# Altium project Mixed Signal Board.PrjPcb (part 2 of 2)
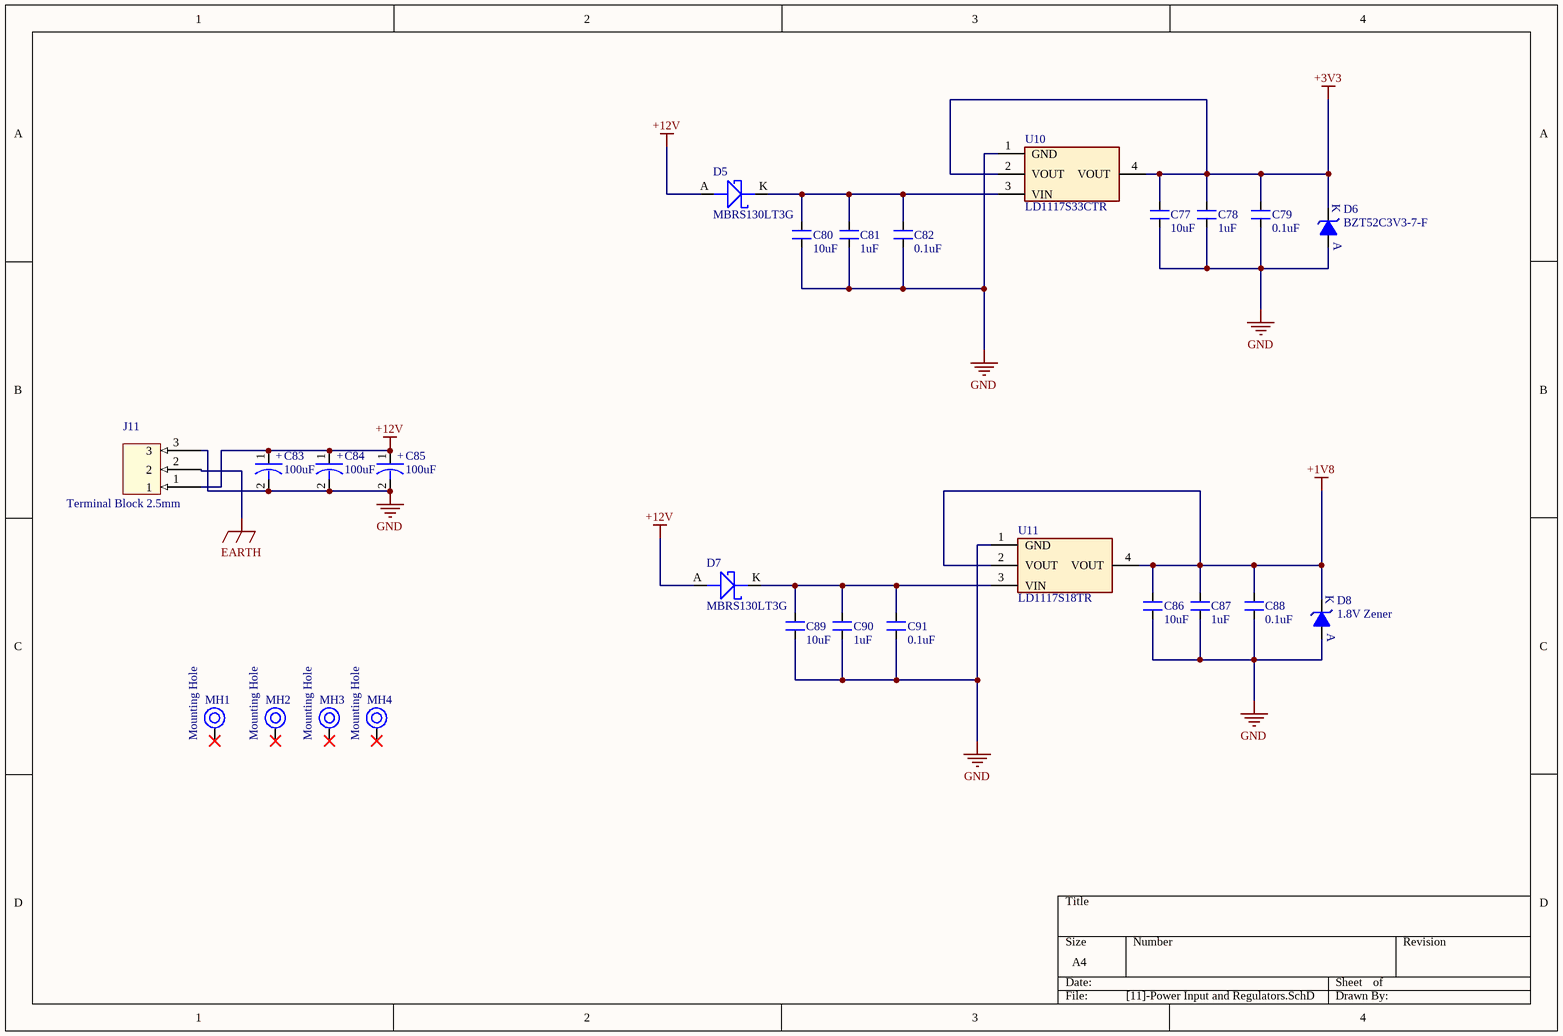
[diagram p11: [11]-Power Input and Regulators.SchDoc]

## Nets that join several sheets
+1V8: [8]- DAC and MIC (C37.2 C38.2 FB3.1 U6.34), [11]-Power Input and Regulators (6 pins)
+3V3: [3]-STM32F103_debugger (14 pins), [4]-Ethernet_PHY (10 pins), [5]-Motor Driver Schematic (R23.1), [6]-CH340C (C27.2 U4.4 U4.16), [7]-ADC Chip (8 pins), [8]- DAC and MIC (12 pins), [9]-STM32F407 Controller (20 pins), [10]-Motor Driver Schematic - 2 (R47.1), [11]-Power Input and Regulators (6 pins)
+12V: [5]-Motor Driver Schematic (7 pins), [10]-Motor Driver Schematic - 2 (6 pins), [11]-Power Input and Regulators (6 pins)
EARTH: [4]-Ethernet_PHY (C21.1 R12.1), [11]-Power Input and Regulators (J11.2)
GND: [3]-STM32F103_debugger (19 pins), [4]-Ethernet_PHY (20 pins), [5]-Motor Driver Schematic (12 pins), [6]-CH340C (C27.1 J5.5 J5.6 U4.1), [7]-ADC Chip (10 pins), [8]- DAC and MIC (25 pins), [9]-STM32F407 Controller (28 pins), [10]-Motor Driver Schematic - 2 (11 pins), [11]-Power Input and Regulators (20 pins)
COL: [4]-Ethernet_PHY (DS1.A U2.28), [9]-STM32F407 Controller (U8.26)
CRS: [4]-Ethernet_PHY (DS2.A U2.29), [9]-STM32F407 Controller (U8.23)
NetR10_1: [4]-Ethernet_PHY (R10.1 U2.11), [9]-STM32F407 Controller (U8.25)
NetR24_2: [5]-Motor Driver Schematic (R24.2 U3.14), [9]-STM32F407 Controller (U8.45)
NetR25_1: [7]-ADC Chip (R25.1 U5.3), [9]-STM32F407 Controller (U8.55)
NetR26_1: [7]-ADC Chip (R26.1 U5.16), [8]- DAC and MIC (U6.2), [9]-STM32F407 Controller (U8.92)
NetR27_1: [7]-ADC Chip (R27.1 U5.15), [8]- DAC and MIC (U6.1), [9]-STM32F407 Controller (U8.93)
NetR32_1: [8]- DAC and MIC (R32.1 U6.32), [9]-STM32F407 Controller (U8.54)
NetR48_2: [9]-STM32F407 Controller (U8.66), [10]-Motor Driver Schematic - 2 (R48.2 U9.14)
NetU1_25: [3]-STM32F103_debugger (U1.25 U1.27), [9]-STM32F407 Controller (U8.72)
NetU1_26: [3]-STM32F103_debugger (U1.26), [9]-STM32F407 Controller (U8.76)
NetU2_12: [4]-Ethernet_PHY (U2.12), [9]-STM32F407 Controller (U8.16)
NetU2_13: [4]-Ethernet_PHY (U2.13), [9]-STM32F407 Controller (U8.36)
NetU2_14: [4]-Ethernet_PHY (U2.14), [9]-STM32F407 Controller (U8.35)
NetU2_15: [4]-Ethernet_PHY (U2.15), [9]-STM32F407 Controller (U8.34)
NetU2_16: [4]-Ethernet_PHY (U2.16), [9]-STM32F407 Controller (U8.33)
NetU2_18: [4]-Ethernet_PHY (U2.18), [9]-STM32F407 Controller (U8.32)
NetU2_19: [4]-Ethernet_PHY (U2.19), [9]-STM32F407 Controller (U8.24)
NetU2_20: [4]-Ethernet_PHY (U2.20), [9]-STM32F407 Controller (U8.47)
NetU2_22: [4]-Ethernet_PHY (U2.22), [9]-STM32F407 Controller (U8.18)
NetU2_23: [4]-Ethernet_PHY (U2.23), [9]-STM32F407 Controller (U8.48)
NetU2_24: [4]-Ethernet_PHY (U2.24), [9]-STM32F407 Controller (U8.51)
NetU2_25: [4]-Ethernet_PHY (U2.25), [9]-STM32F407 Controller (U8.52)
NetU2_26: [4]-Ethernet_PHY (U2.26), [9]-STM32F407 Controller (U8.17)
NetU2_27: [4]-Ethernet_PHY (U2.27), [9]-STM32F407 Controller (U8.1)
NetU3_11: [5]-Motor Driver Schematic (U3.11), [9]-STM32F407 Controller (U8.30)
NetU3_15: [5]-Motor Driver Schematic (U3.15), [9]-STM32F407 Controller (U8.63)
NetU4_2: [6]-CH340C (U4.2), [9]-STM32F407 Controller (U8.78)
NetU4_3: [6]-CH340C (U4.3), [9]-STM32F407 Controller (U8.79)
NetU4_14: [6]-CH340C (U4.14), [9]-STM32F407 Controller (U8.57)
NetU5_14: [7]-ADC Chip (U5.14), [9]-STM32F407 Controller (U8.56)
NetU6_37: [8]- DAC and MIC (U6.37), [9]-STM32F407 Controller (U8.29)
NetU6_38: [8]- DAC and MIC (U6.38), [9]-STM32F407 Controller (U8.89)
NetU6_39: [8]- DAC and MIC (U6.39), [9]-STM32F407 Controller (U8.80)
NetU6_40: [8]- DAC and MIC (U6.40), [9]-STM32F407 Controller (U8.90)
NetU7_3: [8]- DAC and MIC (U7.3), [9]-STM32F407 Controller (U8.65)
NetU7_4: [8]- DAC and MIC (U7.4), [9]-STM32F407 Controller (U8.53)
NetU8_31: [9]-STM32F407 Controller (U8.31), [10]-Motor Driver Schematic - 2 (U9.11)
NetU8_60: [9]-STM32F407 Controller (U8.60), [10]-Motor Driver Schematic - 2 (U9.15)
nFAULT: [5]-Motor Driver Schematic (R16.1 U3.9), [9]-STM32F407 Controller (U8.62)
nFAULT_2: [9]-STM32F407 Controller (U8.59), [10]-Motor Driver Schematic - 2 (R40.1 U9.9)
NTRST_F407: [3]-STM32F103_debugger (U1.18), [9]-STM32F407 Controller (C70.2 R36.2 SW3.1 U8.14)
PHY_RESET: [4]-Ethernet_PHY (R7.1 SW2.2 U2.32), [9]-STM32F407 Controller (U8.64)
SNSOUT: [5]-Motor Driver Schematic (R15.1 U3.10), [9]-STM32F407 Controller (U8.61)
SNSOUT_2: [9]-STM32F407 Controller (U8.58), [10]-Motor Driver Schematic - 2 (R39.1 U9.10)